# Altium schematic sheet HDMI.SchDoc: HDMI
size A4; Project: STM32MP15-DISCO PI; Date: Not used; ApprovedBy: Not used; CheckedBy: Not used; Author: Not used; CompanyName: STMicroelectronics; DrawnBy: Not used; Engineer: Not used; Organization: Not used; Address1: Not used; Address2: Not used; Address3: Not used; Address4: Not used; DocumentNumber: 9; Revision: Not used; SheetNumber: 9; SheetTotal: 15; CurrentTime: Not used; CurrentDate: Not used; Time: Not used; DocumentFullPathAndName: Not used; DocumentName: Not used; ModifiedDate: Not used; ImagePath: Not used; ProjectName: Not used; Application_BuildNumber: Not used
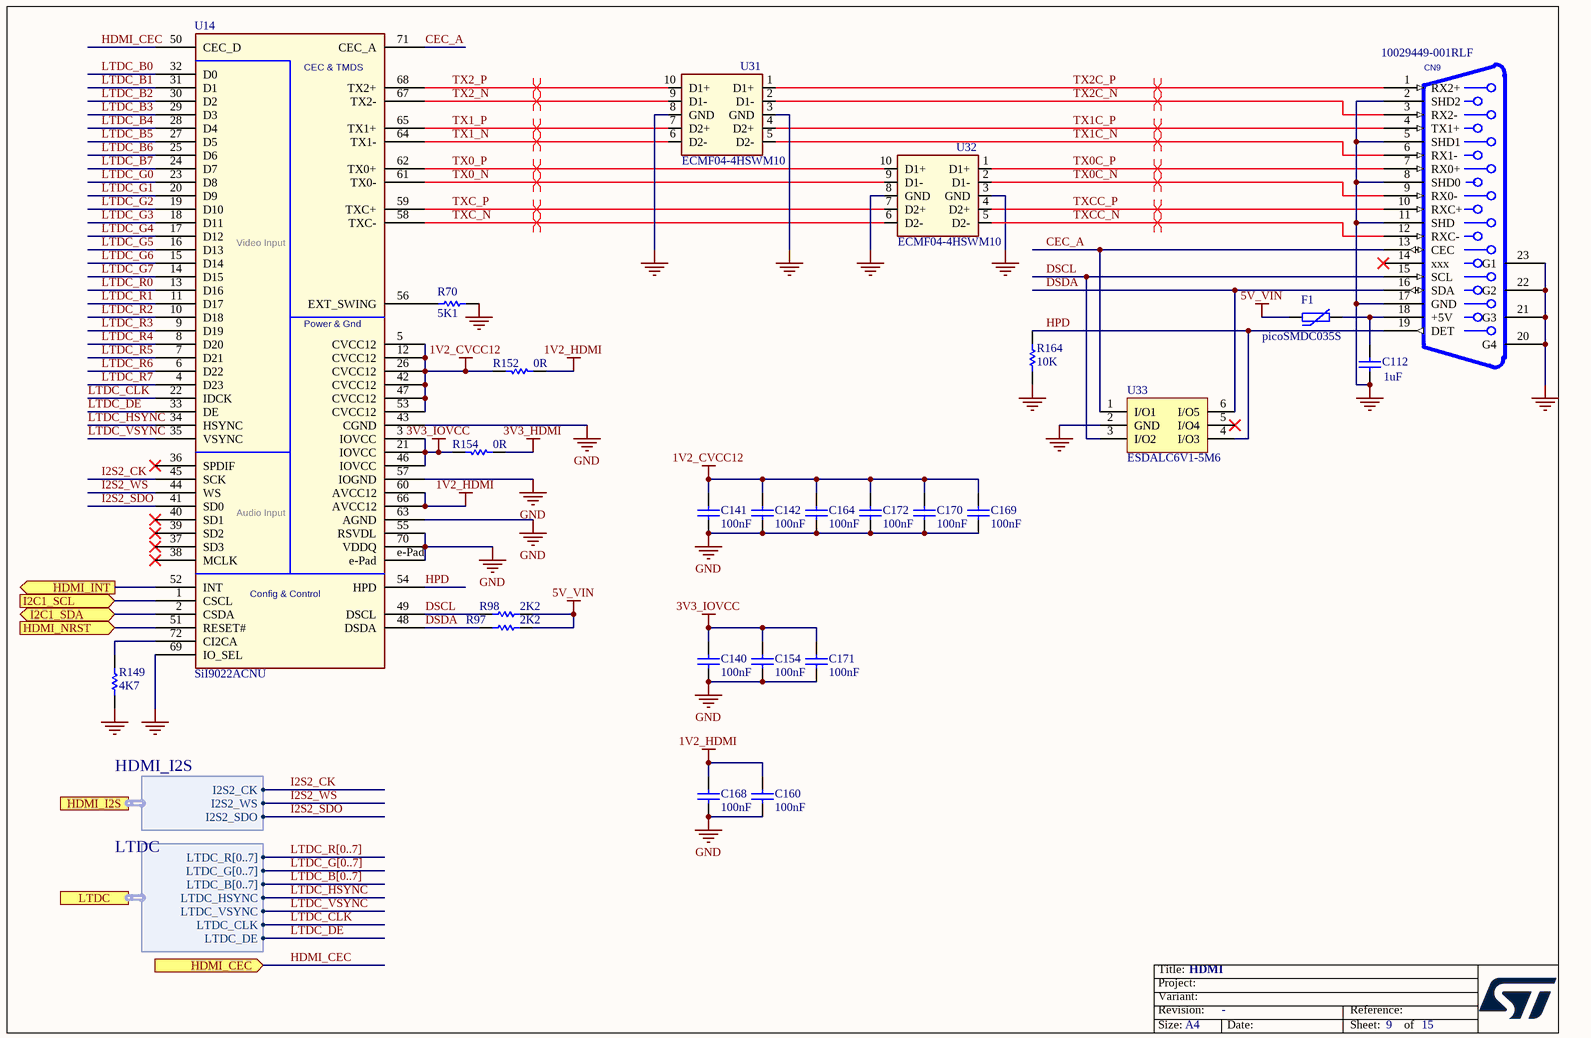
[diagram p0: HDMI.SchDoc]

## Parts
C112  value 1uF  [C0402]
C140  value 100nF  [C0402]
C141  value 100nF  [C0402]
C142  value 100nF  [C0402]
C154  value 100nF  [C0402]
C160  value 100nF  [C0402]
C164  value 100nF  [C0402]
C168  value 100nF  [C0402]
C169  value 100nF  [C0402]
C170  value 100nF  [C0402]
C171  value 100nF  [C0402]
C172  value 100nF  [C0402]
CN9  value 10029449-001RLF  [CON_HDMI_FCI-AMPHENOL_10029449-001RLF]
F1  value picoSMDC035S  [R0805]  (hidden comment: ​f)
R70  value 5K1  [R0402]
R97  value 2K2  [R0402]
R98  value 2K2  [R0402]
R149  value 4K7  [R0402]
R152  value 0R  [R0402]
R154  value 0R  [R0402]
R164  value 10K  [R0402]  (hidden comment: Resistor)
U14  value SiI9022ACNU  [ICC_QFN72-EPAD_10X10_P050]
U31  value ECMF04-4HSWM10  [ESD_UQFN-10L_2P60X1P35_P050]
U32  value ECMF04-4HSWM10  [ESD_UQFN-10L_2P60X1P35_P050]
U33  ESDALC6V1-5M6  [ESD_UQFN-6L_1P45X1_P050]

## Ports
HDMI_CEC (in), HDMI_I2S (harness HDMI_I2S), HDMI_INT (out), HDMI_NRST (in), I2C1_SCL (in), I2C1_SDA (bidir), LTDC (harness LTDC)

## Harnesses
LTDC: LTDC_R[0..7], LTDC_G[0..7], LTDC_B[0..7], LTDC_HSYNC, LTDC_VSYNC, LTDC_CLK, LTDC_DE
HDMI_I2S: I2S2_CK, I2S2_SDO, I2S2_WS

## Nets
1V2_CVCC12: C141.2 C142.2 C164.2 C169.2 C170.2 C172.2 R152.1 U14.5(CVCC12) U14.12(CVCC12) U14.26(CVCC12) U14.42(CVCC12) U14.47(CVCC12) U14.53(CVCC12)
1V2_HDMI: C160.2 C168.2 R152.2 U14.60(AVCC12) U14.66(AVCC12)
3V3_HDMI: R154.2
3V3_IOVCC: C140.2 C154.2 C171.2 R154.1 U14.3(IOVCC) U14.21(IOVCC) U14.46(IOVCC)
5V_VIN: F1.1 R97.2 R98.2
GND: C112.1 C140.1 C141.1 C142.1 C154.1 C160.1 C164.1 C168.1 C169.1 C170.1 C171.1 C172.1 CN9.2(SHD2) CN9.5(SHD1) CN9.8(SHD0) CN9.11(SHD) CN9.17(GND) CN9.20(G4) CN9.21(G3) CN9.22(G2) CN9.23(G1) R70.2 R149.1 R164.1 U14.43(CGND) U14.55(RSVDL) U14.57(IOGND) U14.63(AGND) U14.69(IO_SEL) U14.70(VDDQ) U14.e-Pad U31.3(GND) U31.8(GND) U32.3(GND) U32.8(GND) U33.2(GND)
CEC_A: CN9.13(CEC) U14.71(CEC_A) U33.1(I/O1)
DSCL: CN9.15(SCL) R98.1 U14.49(DSCL) U33.3(I/O2)
DSDA: CN9.16(SDA) R97.1 U14.48(DSDA) U33.6(I/O5)
HDMI_CEC: U14.50(CEC_D) ; port HDMI_CEC
HDMI_INT: U14.52(INT) ; port HDMI_INT
HDMI_NRST: U14.51(RESET#) ; port HDMI_NRST
HPD: CN9.19(DET) R164.2 U14.54(HPD) U33.4(I/O3)
I2C1_SCL: U14.1(CSCL) ; port I2C1_SCL
I2C1_SDA: U14.2(CSDA) ; port I2C1_SDA
I2S2_CK: U14.45(SCK) ; port HDMI_I2S.I2S2_CK
I2S2_SDO: U14.41(SD0) ; port HDMI_I2S.I2S2_SDO
I2S2_WS: U14.44(WS) ; port HDMI_I2S.I2S2_WS
LTDC_B0: U14.32(D0)
LTDC_B1: U14.31(D1)
LTDC_B2: U14.30(D2)
LTDC_B3: U14.29(D3)
LTDC_B4: U14.28(D4)
LTDC_B5: U14.27(D5)
LTDC_B6: U14.25(D6)
LTDC_B7: U14.24(D7)
LTDC_CLK: U14.22(IDCK) ; port LTDC.LTDC_CLK
LTDC_DE: U14.33(DE) ; port LTDC.LTDC_DE
LTDC_G0: U14.23(D8)
LTDC_G1: U14.20(D9)
LTDC_G2: U14.19(D10)
LTDC_G3: U14.18(D11)
LTDC_G4: U14.17(D12)
LTDC_G5: U14.16(D13)
LTDC_G6: U14.15(D14)
LTDC_G7: U14.14(D15)
LTDC_HSYNC: U14.34(HSYNC) ; port LTDC.LTDC_HSYNC
LTDC_R0: U14.13(D16)
LTDC_R1: U14.11(D17)
LTDC_R2: U14.10(D18)
LTDC_R3: U14.9(D19)
LTDC_R4: U14.8(D20)
LTDC_R5: U14.7(D21)
LTDC_R6: U14.6(D22)
LTDC_R7: U14.4(D23)
LTDC_VSYNC: U14.35(VSYNC) ; port LTDC.LTDC_VSYNC
TX0_N: U14.61(TX0-) U32.9(D1-)
TX0_P: U14.62(TX0+) U32.10(D1+)
TX0C_N: CN9.9(RX0-) U32.2(D1-)
TX0C_P: CN9.7(RX0+) U32.1(D1+)
TX1_N: U14.64(TX1-) U31.6(D2-)
TX1_P: U14.65(TX1+) U31.7(D2+)
TX1C_N: CN9.6(RX1-) U31.5(D2-)
TX1C_P: CN9.4(TX1+) U31.4(D2+)
TX2_N: U14.67(TX2-) U31.9(D1-)
TX2_P: U14.68(TX2+) U31.10(D1+)
TX2C_N: CN9.3(RX2-) U31.2(D1-)
TX2C_P: CN9.1(RX2+) U31.1(D1+)
TXC_N: U14.58(TXC-) U32.6(D2-)
TXC_P: U14.59(TXC+) U32.7(D2+)
TXCC_N: CN9.12(RXC-) U32.5(D2-)
TXCC_P: CN9.10(RXC+) U32.4(D2+)
NetC112_2: C112.2 CN9.18(+5V) F1.2
NetR70_1: R70.1 U14.56(EXT_SWING)
NetR149_2: R149.2 U14.72(CI2CA)

Not connected (* = marked no-connect by the designer): CN9 14(xxx)*; U14 36(SPDIF)* 37(SD3)* 38(MCLK)* 39(SD2)* 40(SD1)*; U33 5(I/O4)*

## Buses and harness runs
bus LTDC_B[0..7]
bus LTDC_G[0..7]
bus LTDC_R[0..7]

## Layout directives
differential pair: TX0_N, TX0_P, TX0C_N, TX0C_P, TX1_N, TX1_P, TX1C_N, TX1C_P, TX2_N, TX2_P, TX2C_N, TX2C_P, TXC_N, TXC_P, TXCC_N, TXCC_P

## Notes on the sheet
- Title:
- Project:
- Size:
- Revision:
- Variant:
- A4
- -
- Date:
- Reference:
- Sheet:
- of
- (in symbol MCD-00267) CEC & TMDS; Video Input; Power & Gnd; Audio Input; Config & Control

## Library data of the parts
C112 = MCD-00095: Capacitor,1uF,6V3,X5R,10%,0402; Manufacturer_Part_Number: GRM155R61E105KA12; Manufacturer: MURATA; Alternate_Manufacturer_Part_Number: GRM155R60J105KE19; ECCN_US: EAR99; ECCN_EU: NEC; Provided_By: SUBCO; Initial_Board_Reference: mb1262; Internal_Part_Number: MCD-00095; ComponentLink1Description: Datasheet; Status: Released; Part_Type: Capacitor; Package: C0402; ComponentLink1URL: http://tunmcdsvn.tun.st.com/Component_Datasheet_Library/Trunk/Capacitors/Murata_Capacitor_GR_series; Alternate_Manufacturer: MURATA
C140-C142 C154 C160 C164 C168-C172 = MCD-00006: Capacitor,100nF,16V,X7R,10%,0402; Manufacturer_Part_Number: CC0402KRX7R7BB104; Manufacturer: YAGEO; Alternate_Manufacturer: MURATA; Alternate_Manufacturer_Part_Number: GCM155R71C104KA55D; Provided_By: SUBCO; Initial_Board_Reference: mb1274; Internal_Part_Number: MCD-00006; ComponentLink1Description: Datasheet; ECCN_US: n/a; ECCN_EU: n/a; Status: Released; Part_Type: Capacitor; Package: C0402; ComponentLink1URL: http://tunmcdsvn.tun.st.com/Component_Datasheet_Library/Trunk/Capacitors/Yageo_Multilayer_Capacitor_X7R_series_100pF_to_22uF
CN9 = MCD-00307: HDMI Receptacle Type A 19pins standard Connector; Manufacturer: FCI; Provided_By: SUBCO; Initial_Board_Reference: MB1272; Internal_Part_Number: MCD-00307; Manufacturer_Part_Number: 10029449-001RLF; ComponentLink1Description: Datasheet; ComponentLink1URL: http://tunmcdsvn.tun.st.com/Component_Datasheet_Library/Trunk/Connectors/AMPHENOL_FCI _HDMI_10029449-001RLF; ECCN_US: n/a; ECCN_EU: n/a; Status: Checked; Part_Type: Connector
F1 = MCD-01133: Surface mount resettable polyswitch fuse.I hold=0.35A and I trigger=0.75A; Part_Type: Misc; Manufacturer: TE CONNECTIVITY; Provided_By: SUBCO; Initial_Board_Reference: MB1272; Internal_Part_Number: MCD-01133; Status: Footprint available; Manufacturer_Part_Number: picoSMDC035S; Package: 0805; ComponentLink1Description: Datasheet; ComponentLink1URL: http://tunmcdsvn.tun.st.com/Component_Datasheet_Library/Trunk/Misc/TECONNECTIVITY_PTC_FUSE_PicoSMDCO35S; ECCN_US: n/a; ECCN_EU: n/a
R70 = MCD-00333: Resistor,5K1,0402,1%,1/16W; Manufacturer_Part_Number: RC0402FR-075K1L; Manufacturer: YAGEO; Provided_By: SUBCO; Initial_Board_Reference: mb1272; Internal_Part_Number: MCD-00333; ComponentLink1Description: Datasheet; ECCN_US: n/a; ECCN_EU: n/a; Status: Released; Part_Type: Resistor; ComponentLink1URL: http://tunmcdsvn.tun.st.com/Component_Datasheet_Library/Trunk/Resistors/Yageo_Resistor_RC0402-series; Package: R0402
R97 R98 = MCD-00057: Resistor,2K2,0402,1%,1/16W; Manufacturer_Part_Number: RC0402FR-072K2L; Manufacturer: YAGEO; Provided_By: SUBCO; Initial_Board_Reference: mb1274; Internal_Part_Number: MCD-00057; ComponentLink1Description: Datasheet; ECCN_US: n/a; ECCN_EU: n/a; Status: Released; Part_Type: Resistor; ComponentLink1URL: http://tunmcdsvn.tun.st.com/Component_Datasheet_Library/Trunk/Resistors/Yageo_Resistor_RC0402-series; Package: R0402
R149 = MCD-00065: Resistor,4K7,0402,1%,1/16W; Manufacturer_Part_Number: RC0402FR-074K7L; Manufacturer: YAGEO; Alternate_Manufacturer_Part_Number: RT0402FRE074K7L; Provided_By: SUBCO; Initial_Board_Reference: mb1274; Internal_Part_Number: MCD-00065; Alternate_Manufacturer: YAGEO; ComponentLink1Description: Datasheet; ECCN_US: n/a; ECCN_EU: n/a; Status: Released; Part_Type: Resistor; ComponentLink1URL: http://tunmcdsvn.tun.st.com/Component_Datasheet_Library/Trunk/Resistors/Yageo_Resistor_RC0402-series; Package: R0402
R152 R154 = MCD-00052: Resistor,0R,0402,5%,1/16W; Manufacturer_Part_Number: RC0402JR-070RL; Manufacturer: YAGEO; Provided_By: SUBCO; Initial_Board_Reference: mb1274; Internal_Part_Number: MCD-00052; Status: Released; Part_Type: Resistor; Package: R0402; ComponentLink1Description: Datasheet; ComponentLink1URL: http://tunmcdsvn.tun.st.com/Component_Datasheet_Library/Trunk/Resistors/Yageo_Resistor_RC0402-series; ECCN_US: n/a; ECCN_EU: n/a
R164 = MCD-00053: Resistor,10K,0402,1%,1/16W; Manufacturer_Part_Number: RC0402FR-0710KL; Manufacturer: YAGEO; Provided_By: SUBCO; Initial_Board_Reference: MB1274; Internal_Part_Number: MCD-00053; Status: Released; Part_Type: Resistor; Package: R0402; ComponentLink1Description: Datasheet; ComponentLink1URL: http://tunmcdsvn.tun.st.com/Component_Datasheet_Library/Trunk/Resistors/Yageo_Resistor_RC0402-series; ECCN_US: n/a; ECCN_EU: n/a
U14 = MCD-00267: HDMI Transmitter, 72-pin 10 × 10 mm QFN; Part_Type: IC; Manufacturer: LATTICE; Provided_By: SUBCO; Initial_Board_Reference: MB1272; Internal_Part_Number: MCD-00267; Status: Checked; Manufacturer_Part_Number: SiI9022ACNU; ComponentLink1Description: Datasheet; ComponentLink1URL: http://tunmcdsvn.tun.st.com/Component_Datasheet_Library/Trunk/IC/LATTICE_SiI9022ACNU_HDMI_Transmitter
U31 U32 = MCD-00297: ESD protection & Common Filter High Speed serial Interfaces; Part_Type: Diode; Manufacturer: STMICROELECTRONICS; BMS_Part_Number: 9151127; Provided_By: SUBCO with ST control; Initial_Board_Reference: MB1272; Internal_Part_Number: MCD-00297; Status: Checked; Manufacturer_Part_Number: ECMF04-4HSWM10; ComponentLink1Description: Datasheet; ComponentLink1URL: http://tunmcdsvn.tun.st.com/Component_Datasheet_Library/Trunk/Diodes/STM_ESD_ECMF04-4HSWM10; ECCN_US: n/a; ECCN_EU: n/a
U33 = MCD-01457: ESD protection , 5 lines; Part_Type: Diode; Manufacturer: STMICROELECTRONICS; Provided_By: SUBCO; Initial_Board_Reference: MB1272B; Internal_Part_Number: MCD-01457; Value: ESDALC6V1-5M6; Status: Footprint available; Manufacturer_Part_Number: ESDALC6V1-5M6; Package: QFN; ComponentLink1Description: Datasheet; ComponentLink1URL: http://tunmcdsvn.tun.st.com/Component_Datasheet_Library/Trunk/Diodes/STM_ESD_ESDALC6V1-5M6/STM_ESD_ESDALC6V1-5M6.pdf